# Altium schematic sheet Sheet1.SchDoc
size A4
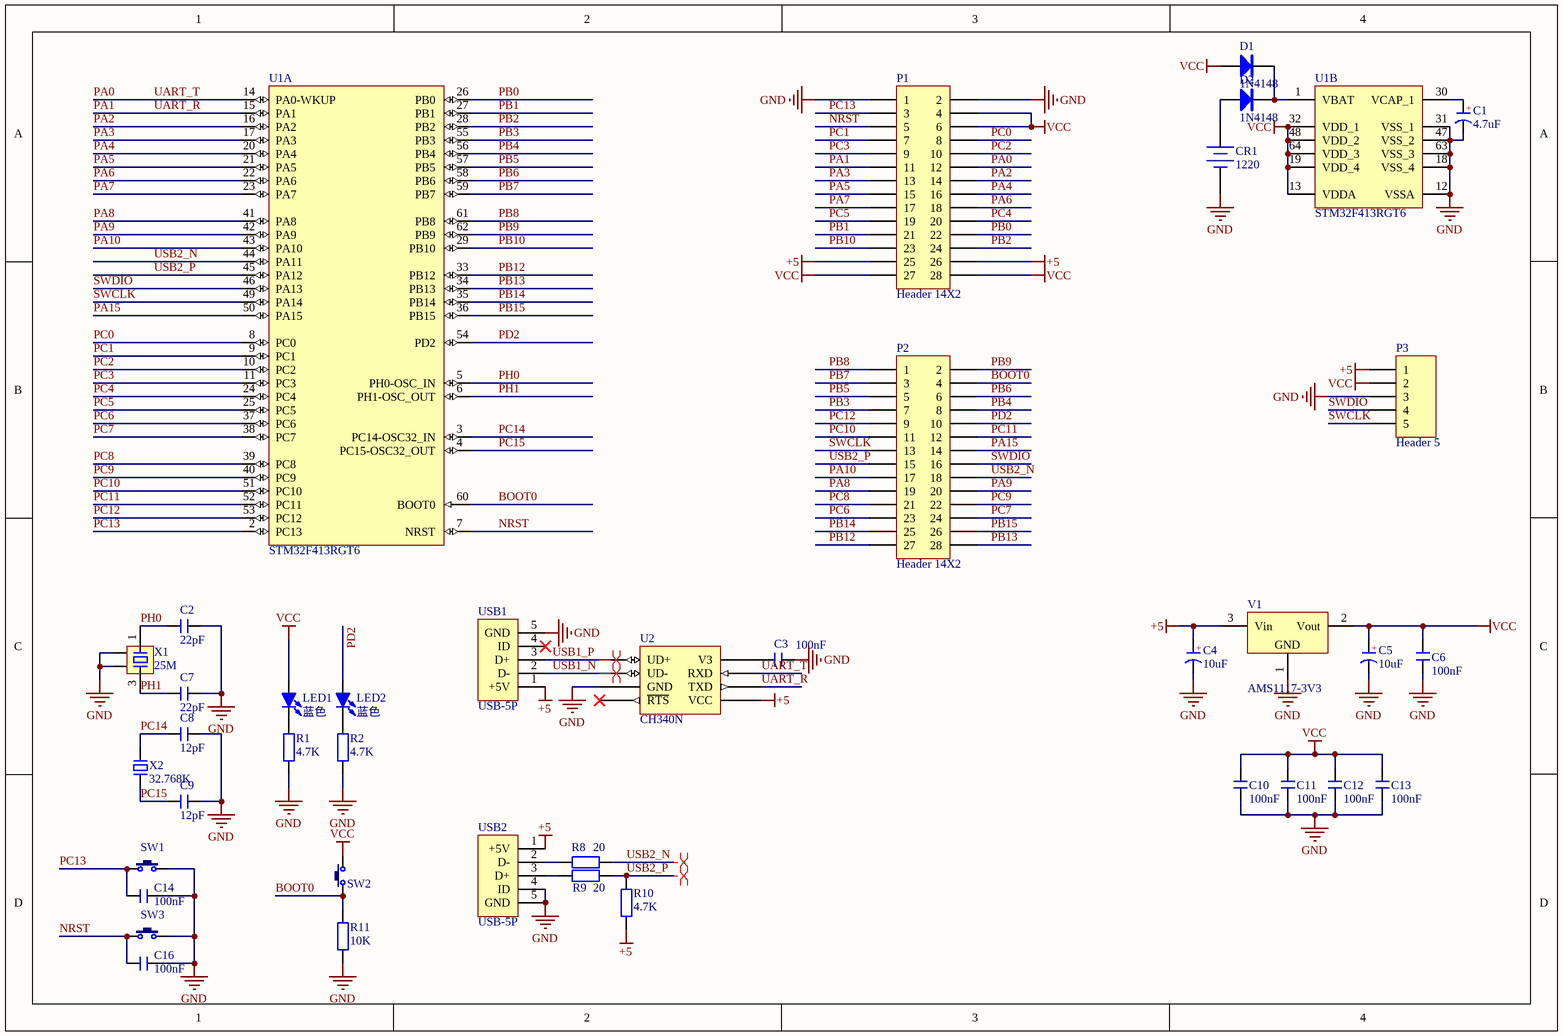
[diagram p0: Sheet1.SchDoc]

## Parts
C1  4.7uF  [CD A(3216)]
C2  22pF  [C 0603_L]
C3  100nF  [C 0603_L]
C4  10uF  [CD A(3216)]
C5  10uF  [CD A(3216)]
C6  100nF  [C 0603_L]
C7  22pF  [C 0603_L]
C8  12pF  [C 0603_L]
C9  12pF  [C 0603_L]
C10  100nF  [C 0603_L]
C11  100nF  [C 0603_L]
C12  100nF  [C 0603_L]
C13  100nF  [C 0603_L]
C14  100nF  [C 0603_L]
C16  100nF  [C 0603_L]
CR1  1220  [CR1220_B]
D1  1N4148  [SOD-323]
D2  1N4148  [SOD-323]
LED1  蓝色  [LED 0805B]
LED2  蓝色  [LED 0805B]
P1  Header 14X2  [HDR2X14]
P2  Header 14X2  [HDR2X14]
P3  Header 5  [HDR1X5]
R1  4.7K  [R 0603_L]
R2  4.7K  [R 0603_L]
R8  20  [R 0603_L]
R9  20  [R 0603_L]
R10  4.7K  [R 0603_L]
R11  10K  [R 0603_L]
SW1  3x6x5  [TSW SMD-3*6*2.5]  (value not drawn)
SW2  3x6x5  [TSW SMD-3*6*2.5]  (value not drawn)
SW3  3x6x5  [TSW SMD-3*6*2.5]  (value not drawn)
U1  STM32F413RGT6  [STM-LQFP64_N]  (parts A,B of 2)
U2  CH340N  [SOP8]
USB1  USB-5P  [USB-MICRO]
USB2  USB-5P  [USB-MICRO]
V1  AMS1117-3V3  [SOT223_L]
X1  25M  [OSC 3225-4P]
X2  32.768K  [OSC 3215-2P]

## Nets
+5: C4.1(A) P1.25 P1.26 P3.1 R10.1 U2.5(VCC) USB1.1(+5V) USB2.1(+5V) V1.3(Vin)
GND: C1.2(K) C2.2 C3.1 C4.2(K) C5.2(K) C6.1 C7.2 C8.2 C9.2 C10.1 C11.1 C12.1 C13.1 C14.2 C16.2 CR1.2(DC-) P1.1 P1.2 P3.3 R1.1 R2.1 R11.1 SW1.2 SW3.2 U1.12(VSSA) U1.18(VSS_4) U1.31(VSS_1) U1.47(VSS_2) U1.63(VSS_3) U2.3(GND) USB1.5(GND) USB2.4(ID) USB2.5(GND) V1.1(GND) X1.2 X1.4
VCC: C5.1(A) C6.2 C10.2 C11.2 C12.2 C13.2 D1.1(A) LED1.1(A) P1.4 P1.6 P1.27 P1.28 P3.2 SW2.2 U1.13(VDDA) U1.19(VDD_4) U1.32(VDD_1) U1.48(VDD_2) U1.64(VDD_3) V1.2(Vout)
BOOT0: P2.4 R11.2 SW2.1 U1.60(BOOT0)
NRST: C16.1 P1.5 SW3.1 U1.7(NRST)
PA0: P1.12 U1.14(PA0-WKUP) U2.7(RXD)  [also labelled UART_T]
PA1: P1.11 U1.15(PA1) U2.6(TXD)  [also labelled UART_R]
PA2: P1.14 U1.16(PA2)
PA3: P1.13 U1.17(PA3)
PA4: P1.16 U1.20(PA4)
PA5: P1.15 U1.21(PA5)
PA6: P1.18 U1.22(PA6)
PA7: P1.17 U1.23(PA7)
PA8: P2.19 U1.41(PA8)
PA9: P2.20 U1.42(PA9)
PA10: P2.17 U1.43(PA10)
PA15: P2.14 U1.50(PA15)
PB0: P1.22 U1.26(PB0)
PB1: P1.21 U1.27(PB1)
PB2: P1.24 U1.28(PB2)
PB3: P2.7 U1.55(PB3)
PB4: P2.8 U1.56(PB4)
PB5: P2.5 U1.57(PB5)
PB6: P2.6 U1.58(PB6)
PB7: P2.3 U1.59(PB7)
PB8: P2.1 U1.61(PB8)
PB9: P2.2 U1.62(PB9)
PB10: P1.23 U1.29(PB10)
PB12: P2.27 U1.33(PB12)
PB13: P2.28 U1.34(PB13)
PB14: P2.25 U1.35(PB14)
PB15: P2.26 U1.36(PB15)
PC0: P1.8 U1.8(PC0)
PC1: P1.7 U1.9(PC1)
PC2: P1.10 U1.10(PC2)
PC3: P1.9 U1.11(PC3)
PC4: P1.20 U1.24(PC4)
PC5: P1.19 U1.25(PC5)
PC6: P2.23 U1.37(PC6)
PC7: P2.24 U1.38(PC7)
PC8: P2.21 U1.39(PC8)
PC9: P2.22 U1.40(PC9)
PC10: P2.11 U1.51(PC10)
PC11: P2.12 U1.52(PC11)
PC12: P2.9 U1.53(PC12)
PC13: C14.1 P1.3 SW1.1 U1.2(PC13)
PC14: C8.1 U1.3(PC14-OSC32_IN) X2.2
PC15: C9.1 U1.4(PC15-OSC32_OUT) X2.1
PD2: LED2.1(A) P2.10 U1.54(PD2)
PH0: C2.1 U1.5(PH0-OSC_IN) X1.1
PH1: C7.1 U1.6(PH1-OSC_OUT) X1.3
SWCLK: P2.13 P3.5 U1.49(PA14)
SWDIO: P2.16 P3.4 U1.46(PA13)
USB1_N: U2.2(UD-) USB1.2(D-)
USB1_P: U2.1(UD+) USB1.3(D+)
USB2_N: P2.18 R8.1 U1.44(PA11)
USB2_P: P2.15 R9.1 R10.2 U1.45(PA12)
NetC1_1: C1.1(A) U1.30(VCAP_1)
NetC3_2: C3.2 U2.8(V3)
NetCR1_1: CR1.1(DC+) D2.1(A)
NetD1_2: D1.2(K) D2.2(K) U1.1(VBAT)
NetLED1_2: LED1.2(K) R1.2
NetLED2_2: LED2.2(K) R2.2
NetR8_2: R8.2 USB2.2(D-)
NetR9_2: R9.2 USB2.3(D+)

Not connected (* = marked no-connect by the designer): U2 4(~{RTS})*; USB1 4(ID)*

## Layout directives
differential pair: USB1_N, USB1_P, USB2_N, USB2_P

## Notes on the sheet
- (in symbol CT) +

## Library data of the parts
C1 = CT: 贴片钽电容; 淘宝ID: 封装库来自淘宝 ID：黄晶宝石; BOM名称: 贴片钽电容; 联系售后: https://shop463601444.taobao.com; Value: 4.7uF
C2 C3 C6-C14 C16 = C: 贴片电容; BOM名称: 无极性贴片电容; 淘宝ID: 封装库来自淘宝 ID：黄晶宝石; 联系售后，技术支持: https://shop463601444.taobao.com; 唯一出售店铺网址: https://shop463601444.taobao.com
C4 C5 = CT: 贴片钽电容; 淘宝ID: 封装库来自淘宝 ID：黄晶宝石; Value: 4.7uF; BOM名称: 贴片钽电容; 联系售后: https://shop463601444.taobao.com
CR1 = CR-3V: 微型电池; 版权归属: 封装库来自淘宝 ID：黄晶宝石; BOM名称: 微型电池; 学习资源: https://shop463601444.taobao.com
D1 D2 = 1N4148: 开关二极管; BOM名称: 高速开关二极管; 淘宝ID: 封装库来自淘宝 ID：黄晶宝石; 欢迎光临: https://shop463601444.taobao.com
LED1 LED2 = LED-SMD: 贴片LED; 版权归属: 封装库来自淘宝 ID：黄晶宝石; BOM名称: 贴片LED; 学习资源: https://shop463601444.taobao.com
P1 P2 = Header 14X2: Header, 14-Pin, Dual row; LatestRevisionDate: 17-Jul-2002; LatestRevisionNote: Re-released for DXP Platform.; Publisher: Altium Limited
P3 = Header 5: Header, 5-Pin; LatestRevisionDate: 17-Jul-2002; LatestRevisionNote: Re-released for DXP Platform.; Publisher: Altium Limited
R1 R2 R8-R11 = R: 贴片电阻; 版权归属: 来自淘宝 ID：黄晶宝石; 封装库来自淘宝卖家 ID：黄晶宝石: 其他店铺购入均为盗版，不享受售后技术支持服务，请立即申请退款; BOM名称: 贴片电阻; 联系售后: https://shop463601444.taobao.com
SW1-SW3 = TSW 3x6: 3x6轻触开关; 版权归属: 封装库来自淘宝 ID：黄晶宝石; BOM名称: 3x6轻触开关; 学习资源: https://shop463601444.taobao.com
U1 = STM32F413RGT6: ARM Cortex-M4 32-bit MCU, 1024 KB Flash, 320 KB Internal RAM, 50 I/Os, 64-pin LQFP, -40 to 125 degC, Tray; PartNumber: STM32F103RCT6; A/D Converter: 3x12-bit (16 Channel); Core: ARM Cortex-M3; D/A Converter: 2x12-bit (2 Channel); FLASH Size (Prog) (kB): 256; I/Os (High Current): 51; Internal RAM Size (kB): 48; Operating Frequency(F) (Processor speed) (MHz): 72; Supply Voltage(Vcc) min (V): 2; DatasheetVersion: Rev. 8; PackageVersion: Rev. 4, 06/2013; PackageReference: LQFP64; PackageDescription: 64-Pin Low Profile Quad Flat Package, 10 x 10 mm Body, 0.5 mm Pitch; Supplier 1: Digi-Key; Supplier Part Number 1: 497-9033-ND; Supplier 2: Newark; Supplier Part Number 2: 01P4099; Supplier 3: Newark; Supplier Part Number 3: 57P1227; Supplier 4: Mouser; Supplier Part Number 4: 511-STM32F103RCT6; Packing: Tray; Mounting Technology: Surface Mount; ComponentLink1Description: Manufacturer URL; ComponentLink1URL: http://www.st.com/web/en/home.html; ComponentLink2Description: Datasheet; ComponentLink2URL: http://www.st.com/st-web-ui/static/active/en/resource/technical/document/datasheet/CD00191185.pdf; ComponentLink3Description: Package Specification; ComponentLink3URL: http://www.st.com/st-web-ui/static/active/en/resource/technical/document/datasheet/DM00037051.pdf
U2 = CH340N: SOP8封装USB转串口芯片
USB1 USB2 = USB-5P: 微型USB母座; BOM名称: 微型USB母座; 学习资源: https://shop463601444.taobao.com
V1 = AMS1117: 三端稳压芯片; BOM名称: 稳压芯片; 淘宝ID: 封装库来自淘宝 ID：黄晶宝石; 欢迎光临淘宝店铺: https://shop463601444.taobao.com
X1 = XTAL-4P: 4脚无源晶振; 版权归属: 封装库来自淘宝卖家 ID：黄晶宝石; Value: 25MHz; BOM名称: 4脚无源晶振; 学习资源: https://shop463601444.taobao.com
X2 = XTAL-2P: 2脚无源脚晶振; 版权归属: 封装库来自淘宝卖家 ID：黄晶宝石; BOM名称: 2脚无源脚晶振; 学习资源: https://shop463601444.taobao.com